# EAGLE design bottom-pcb (EAGLE 6.4)
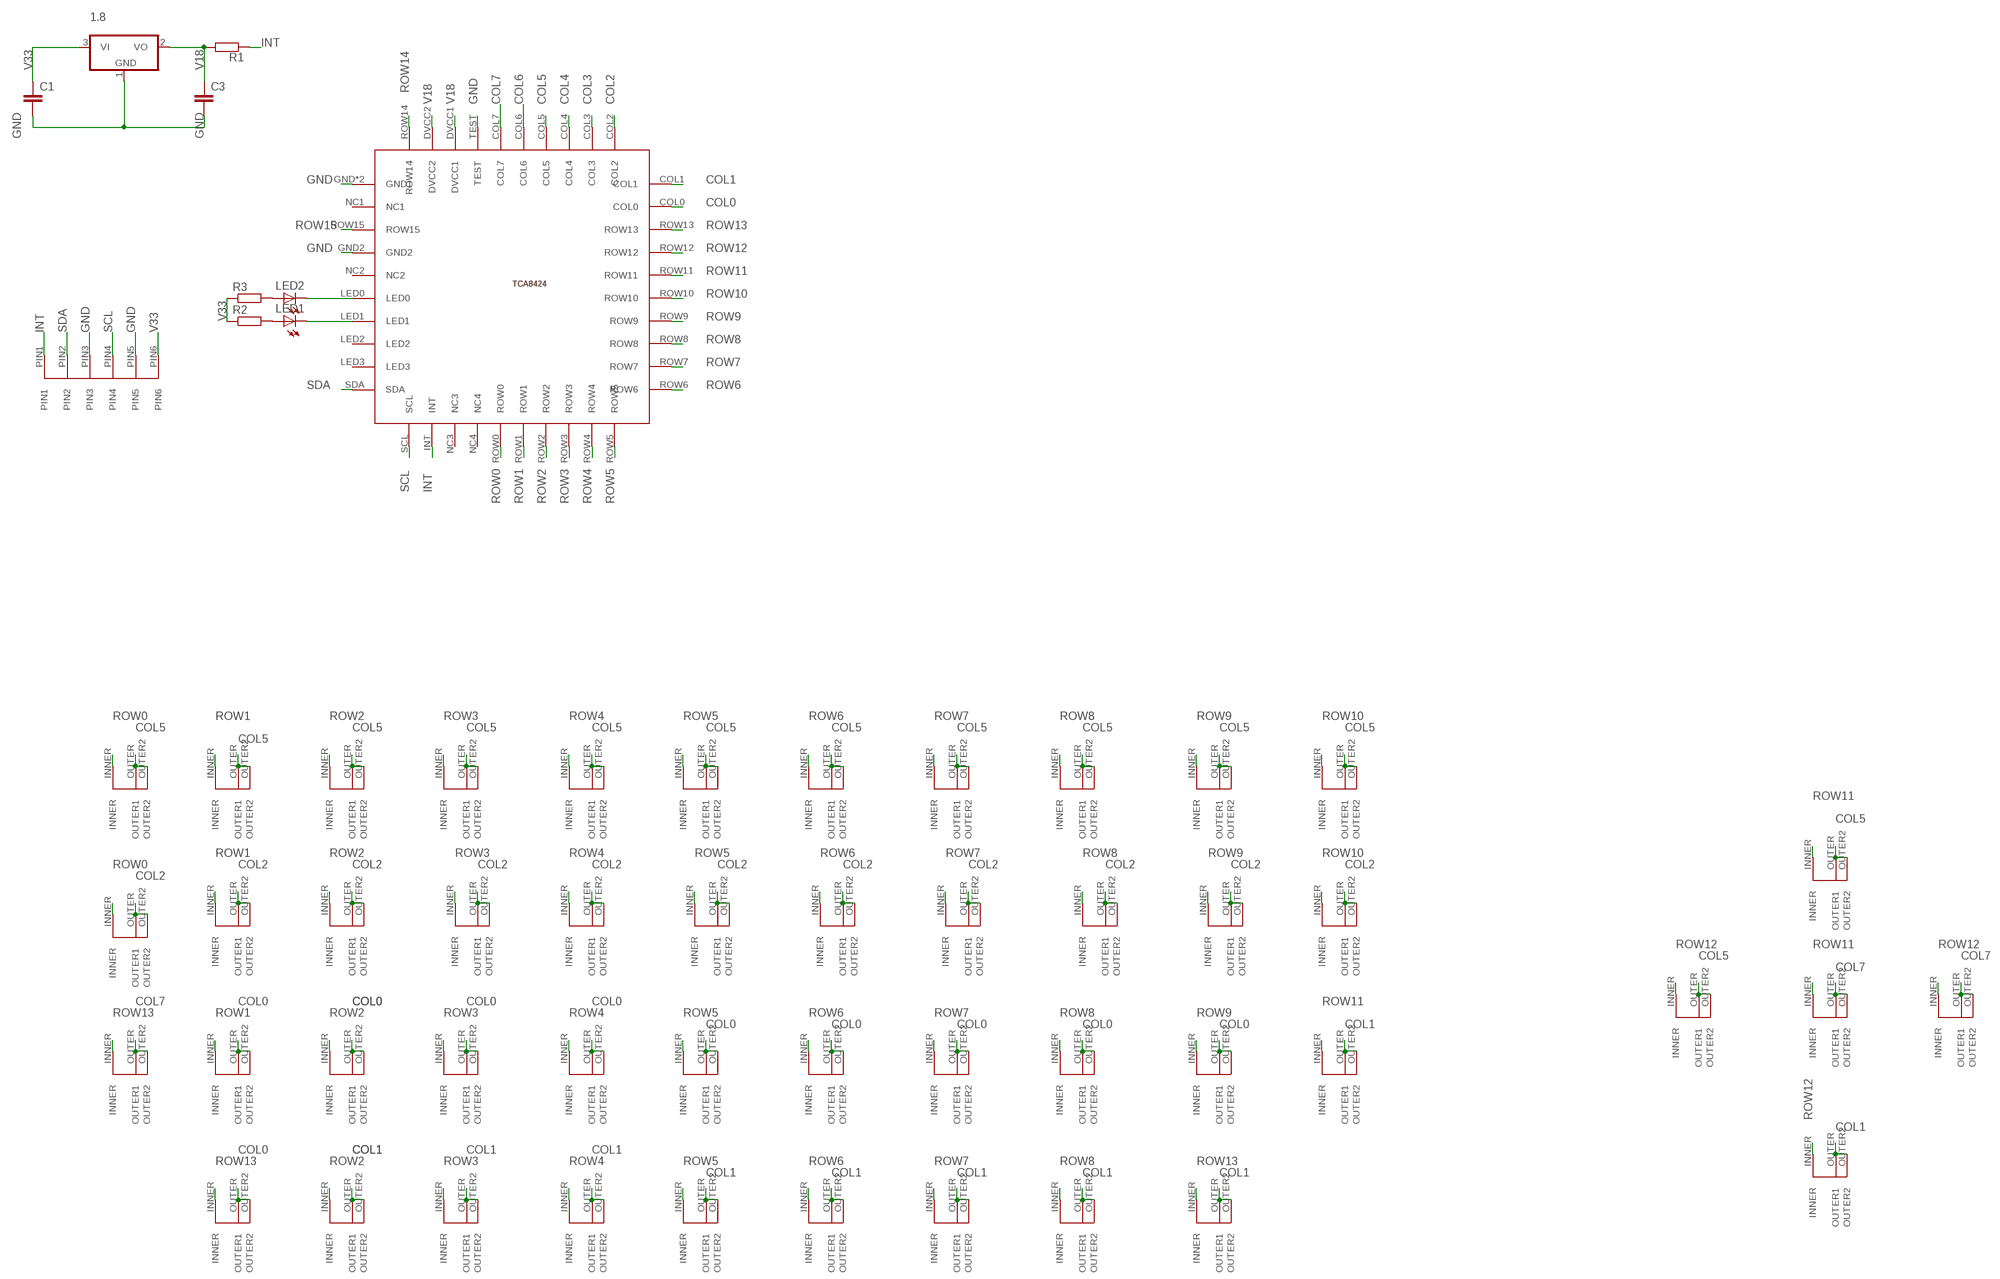
[diagram p0: schematic, sheet 1]

## Parts
1.8  MCP1703CB  [SOT23]
?  BUTTON  [BUTTON]
A  BUTTON  [BUTTON]
ARROWDOWN  BUTTON  [BUTTON]
ARROWLEFT  BUTTON  [BUTTON]
ARROWRIGHT  BUTTON  [BUTTON]
ARROWUP  BUTTON  [BUTTON]
AT  BUTTON  [BUTTON]
B  BUTTON  [BUTTON]
C  BUTTON  [BUTTON]
C1  C-EUC0603  [C0603]
C3  C-EUC0603  [C0603]
D  BUTTON  [BUTTON]
DEL  BUTTON  [BUTTON]
E3  BUTTON  [BUTTON]
ENTER  BUTTON  [BUTTON]
F  BUTTON  [BUTTON]
G  BUTTON  [BUTTON]
H  BUTTON  [BUTTON]
I8  BUTTON  [BUTTON]
J  BUTTON  [BUTTON]
K  BUTTON  [BUTTON]
KOMMA  BUTTON  [BUTTON]
L  BUTTON  [BUTTON]
LED1  LEDCHIPLED_0603  [CHIPLED_0603]
LED2  LEDCHIPLED_0603  [CHIPLED_0603]
LEFT-ALT  BUTTON  [BUTTON]
LIST  BUTTON  [BUTTON]
M  BUTTON  [BUTTON]
N  BUTTON  [BUTTON]
O9  BUTTON  [BUTTON]
OK  BUTTON  [BUTTON]
P0  BUTTON  [BUTTON]
PUNT  BUTTON  [BUTTON]
Q1  BUTTON  [BUTTON]
R1  R-EU_R0603  [R0603]
R2  R-EU_R0603  [R0603]
R3  R-EU_R0603  [R0603]
R4  BUTTON  [BUTTON]
RIGHT-ALT  BUTTON  [BUTTON]
S  BUTTON  [BUTTON]
SEARCH  BUTTON  [BUTTON]
SHIFT  BUTTON  [BUTTON]
SHIFT2  BUTTON  [BUTTON]
SLASH  BUTTON  [BUTTON]
SPACE1  BUTTON  [BUTTON]
SPACE2  BUTTON  [BUTTON]
SPACE3  BUTTON  [BUTTON]
T5  BUTTON  [BUTTON]
TCA8424-1  QFN40-TCA8424  [QFN40-TCA8424]
U7  BUTTON  [BUTTON]
U$1  6PCONNECTOR  [6PCONNECTOR]
V  BUTTON  [BUTTON]
W2  BUTTON  [BUTTON]
X  BUTTON  [BUTTON]
Y6  BUTTON  [BUTTON]
Z  BUTTON  [BUTTON]

## Nets
COL0: B.OUTER2 B.OUTER(OUTER1) C.OUTER2 C.OUTER(OUTER1) KOMMA.OUTER2 KOMMA.OUTER(OUTER1) LEFT-ALT.OUTER2 LEFT-ALT.OUTER(OUTER1) M.OUTER2 M.OUTER(OUTER1) N.OUTER2 N.OUTER(OUTER1) PUNT.OUTER2 PUNT.OUTER(OUTER1) TCA8424-1.COL0 V.OUTER2 V.OUTER(OUTER1) X.OUTER2 X.OUTER(OUTER1) Z.OUTER2 Z.OUTER(OUTER1)
COL1: ARROWDOWN.OUTER2 ARROWDOWN.OUTER(OUTER1) AT.OUTER2 AT.OUTER(OUTER1) LIST.OUTER2 LIST.OUTER(OUTER1) RIGHT-ALT.OUTER2 RIGHT-ALT.OUTER(OUTER1) SEARCH.OUTER2 SEARCH.OUTER(OUTER1) SHIFT2.OUTER2 SHIFT2.OUTER(OUTER1) SLASH.OUTER2 SLASH.OUTER(OUTER1) SPACE1.OUTER2 SPACE1.OUTER(OUTER1) SPACE2.OUTER2 SPACE2.OUTER(OUTER1) SPACE3.OUTER2 SPACE3.OUTER(OUTER1) TCA8424-1.COL1
COL2: ?.OUTER2 ?.OUTER(OUTER1) A.OUTER2 A.OUTER(OUTER1) D.OUTER2 D.OUTER(OUTER1) ENTER.OUTER2 ENTER.OUTER(OUTER1) F.OUTER2 F.OUTER(OUTER1) G.OUTER2 G.OUTER(OUTER1) H.OUTER2 H.OUTER(OUTER1) J.OUTER2 J.OUTER(OUTER1) K.OUTER2 K.OUTER(OUTER1) L.OUTER2 L.OUTER(OUTER1) S.OUTER2 S.OUTER(OUTER1) TCA8424-1.COL2
COL3: TCA8424-1.COL3
COL4: TCA8424-1.COL4
COL5: ARROWLEFT.OUTER2 ARROWLEFT.OUTER(OUTER1) ARROWUP.OUTER2 ARROWUP.OUTER(OUTER1) DEL.OUTER2 DEL.OUTER(OUTER1) E3.OUTER2 E3.OUTER(OUTER1) I8.OUTER2 I8.OUTER(OUTER1) O9.OUTER2 O9.OUTER(OUTER1) P0.OUTER2 P0.OUTER(OUTER1) Q1.OUTER2 Q1.OUTER(OUTER1) R4.OUTER2 R4.OUTER(OUTER1) T5.OUTER2 T5.OUTER(OUTER1) TCA8424-1.COL5 U7.OUTER2 U7.OUTER(OUTER1) W2.OUTER2 W2.OUTER(OUTER1) Y6.OUTER2 Y6.OUTER(OUTER1)
COL6: TCA8424-1.COL6
COL7: ARROWRIGHT.OUTER2 ARROWRIGHT.OUTER(OUTER1) OK.OUTER2 OK.OUTER(OUTER1) SHIFT.OUTER2 SHIFT.OUTER(OUTER1) TCA8424-1.COL7
GND: 1.8.1(GND) C1.2 C3.2 TCA8424-1.GND1 TCA8424-1.GND2 TCA8424-1.GND(GND1) TCA8424-1.TEST U$1.PIN3 U$1.PIN5
INT: R1.1 TCA8424-1.INT U$1.PIN1
N$6: LED1.C TCA8424-1.LED1
N$7: LED2.C TCA8424-1.LED0
N$8: LED1.A R2.2
N$9: LED2.A R3.2
ROW0: A.INNER Q1.INNER TCA8424-1.ROW0
ROW1: S.INNER TCA8424-1.ROW1 W2.INNER Z.INNER
ROW2: D.INNER E3.INNER SEARCH.INNER TCA8424-1.ROW2 X.INNER
ROW3: AT.INNER C.INNER F.INNER R4.INNER TCA8424-1.ROW3
ROW4: G.INNER SPACE1.INNER T5.INNER TCA8424-1.ROW4 V.INNER
ROW5: B.INNER H.INNER SPACE2.INNER TCA8424-1.ROW5 Y6.INNER
ROW6: J.INNER N.INNER SPACE3.INNER TCA8424-1.ROW6 U7.INNER
ROW7: I8.INNER K.INNER M.INNER SLASH.INNER TCA8424-1.ROW7
ROW8: KOMMA.INNER L.INNER LIST.INNER O9.INNER TCA8424-1.ROW8
ROW9: ?.INNER P0.INNER PUNT.INNER TCA8424-1.ROW9
ROW10: DEL.INNER ENTER.INNER TCA8424-1.ROW10
ROW11: ARROWUP.INNER OK.INNER SHIFT2.INNER TCA8424-1.ROW11
ROW12: ARROWDOWN.INNER ARROWLEFT.INNER ARROWRIGHT.INNER TCA8424-1.ROW12
ROW13: LEFT-ALT.INNER RIGHT-ALT.INNER SHIFT.INNER TCA8424-1.ROW13
ROW14: TCA8424-1.ROW14
ROW15: TCA8424-1.ROW15
SCL: TCA8424-1.SCL U$1.PIN4
SDA: TCA8424-1.SDA U$1.PIN2
V18: 1.8.2(VO) C3.1 R1.2 TCA8424-1.DVCC1 TCA8424-1.DVCC2
V33: 1.8.3(VI) C1.1 R2.1 R3.1 U$1.PIN6
Unconnected: TCA8424-1.LED2 TCA8424-1.LED3 TCA8424-1.NC1 TCA8424-1.NC2 TCA8424-1.NC3 TCA8424-1.NC4

## Library data of the parts
1.8 = linear:MCP1703: 250 mA, 16V, Low Quiescent Current LDO Regulator Source: http://ww1.microchip.com/downloads/en/DeviceDoc/22049b.pdf
? A ARROWDOWN ARROWLEFT ARROWRIGHT ARROWUP AT B C D DEL E3 ENTER F G H I8 J K KOMMA L LEFT-ALT LIST M N O9 OK P0 PUNT Q1 R4 RIGHT-ALT S SEARCH SHIFT SHIFT2 SLASH SPACE1-SPACE3 T5 U7 V W2 X Y6 Z = button:BUTTON
C1 C3 = rcl:C-EU: CAPACITOR, European symbol
LED1 LED2 = led:LED: LED OSRAM: - CHIPLED LG R971, LG N971, LY N971, LG Q971, LY Q971, LO R971, LY R971 LH N974, LH R974 LS Q976, LO Q976, LY Q976 LO Q996 - Hyper CHIPLED LW Q18S LB Q993, LB Q99A, LB R99A - SideLED LS A670, LO A670, LY A670, LG A670, LP A670 LB A673, LV A673, LT A673, LW A673 LH A674 LY A675 LS A676, LA A676, LO A676, LY A676, LW A676 LS A679, LY A679, LG A679 - Hyper Micro SIDELED® LS Y876, LA Y876, LO Y876, LY Y876 LT Y87S - SmartLED LW L88C, LW L88S LB L89C, LB L89S, LG L890 LS L89K, LO L89K, LY L89K LS L896, LA L896, LO L896, LY L896 - TOPLED LS T670, LO T670, LY T670, LG T670, LP T670 LSG T670, LSP T670, LSY T670, LOP T670, LYG T670 LG T671, LOG T671, LSG T671 LB T673, LV T673, LT T673, LW T673 LH T674 LS T676, LA T676, LO T676, LY T676, LB T676, LH T676, LSB T676, LW T676 LB T67C, LV T67C, LT T67C, LS T67K, LO T67K, LY T67K, LW E67C LS E67B, LA E67B, LO E67B, LY E67B, LB E67C, LV E67C, LT E67C LW T67C LS T679, LY T679, LG T679 LS T770, LO T770, LY T770, LG T770, LP T770 LB T773, LV T773, LT T773, LW T773 LH T774 LS E675, LA E675, LY E675, LS T675 LS T776, LA T776, LO T776, LY T776, LB T776 LHGB T686 LT T68C, LB T68C - Hyper Mini TOPLED® LB M676 - Mini TOPLED Santana® LG M470 LS M47K, LO M47K, LY M47K Source: http://www.osram.convergy.de LUXEON: - LUMILED® LXK2-PW12-R00, LXK2-PW12-S00, LXK2-PW14-U00, LXK2-PW14-V00 LXK2-PM12-R00, LXK2-PM12-S00, LXK2-PM14-U00 LXK2-PE12-Q00, LXK2-PE12-R00, LXK2-PE12-S00, LXK2-PE14-T00, LXK2-PE14-U00 LXK2-PB12-K00, LXK2-PB12-L00, LXK2-PB12-M00, LXK2-PB14-N00, LXK2-PB14-P00, LXK2-PB14-Q00 LXK2-PR12-L00, LXK2-PR12-M00, LXK2-PR14-Q00, LXK2-PR14-R00 LXK2-PD12-Q00, LXK2-PD12-R00, LXK2-PD12-S00 LXK2-PH12-R00, LXK2-PH12-S00 LXK2-PL12-P00, LXK2-PL12-Q00, LXK2-PL12-R00 Source: www.luxeon.com KINGBRIGHT: KA-3528ASYC Source: www.kingbright.com
R1 = resistor:R-EU_: RESISTOR, European symbol
R2 R3 = rcl:R-EU_: RESISTOR, European symbol
TCA8424-1 = TCA8424:QFN40-TCA8424
U$1 = 6Pconnector:6PCONNECTOR

## Board
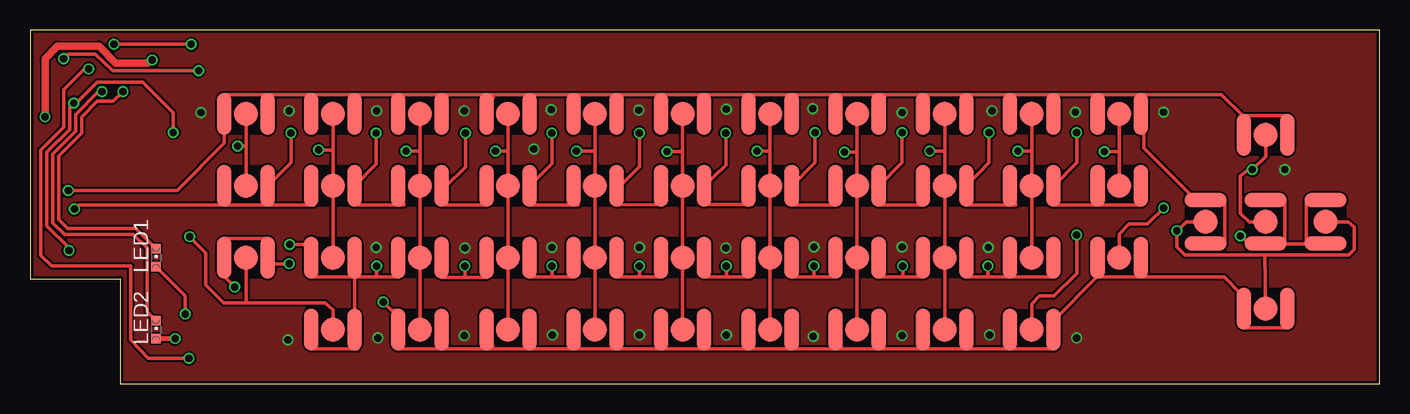
[diagram p1: board, top side]
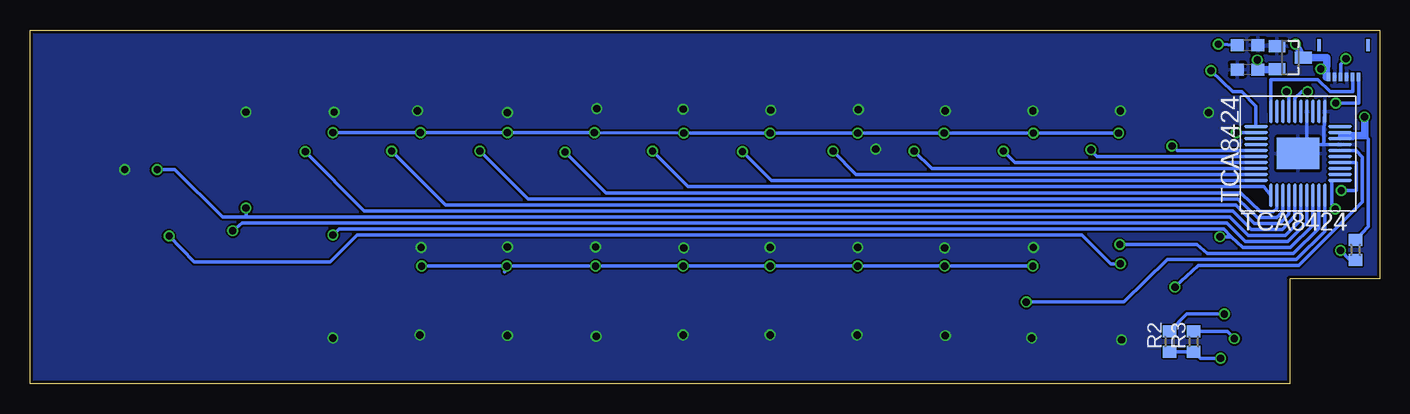
[diagram p2: board, bottom side, seen from below]

Size 112.5 x 29.5 mm. Coordinates in mm from the lower left corner, seen from the top.
Outline: 7.5,0 112.5,0 112.5,29.5 0,29.5 0,8.75 7.5,8.75 7.5,0
Copper layers (1*2*15*16): Top 0.035mm / dielectric 0.2mm / Route2 0.0175mm / dielectric 1.1mm / Route15 0.0175mm / dielectric 0.2mm / Bottom 0.035mm
Design rules "SeeedStudio_DRU_no_angle_20130527": minimum track width 6mil, minimum drill 12mil, track to track 6mil, track to pad 6mil, pad to pad 6mil, via to via 6mil, smd to smd 0mil, copper to edge 10mil, drill to drill 10mil, minimum pad ring 6mil, minimum via ring 6mil, stop-mask expansion 2mil, vias tented up to drill 25mil, thermal gap 10mil

### Footprints (pad centres in the part's own frame; a part is rotated, then mirrored left to right if it is on the bottom)
SOT23 = smd 1 x 1.4: 1 -0.95,-1.1; 2 0.95,-1.1; 3 0,1.1
BUTTON = smd 2 x 2: INNER 0,0 | smd 1.2 x 3.5: OUTER -1.8,0; OUTER2 1.8,0
C0603 = smd 1.1 x 1: 1 -0.85,0; 2 0.85,0
CHIPLED_0603 = smd 0.8 x 0.8: A 0,-0.75; C 0,0.75
R0603 = smd 1 x 1.1: 1 -0.85,0; 2 0.85,0
QFN40-TCA8424 = smd 2 x 0.25: COL0 3.5,1.75; COL1 3.5,2.25; GND1 -3.5,2.25; GND2 -3.5,0.75; LED0 -3.5,-0.25; LED1 -3.5,-0.75; LED2 -3.5,-1.25; LED3 -3.5,-1.75; NC1 -3.5,1.75; NC2 -3.5,0.25; ROW6 3.5,-2.25; ROW7 3.5,-1.75; ROW8 3.5,-1.25; ROW9 3.5,-0.75; ROW10 3.5,-0.25; ROW11 3.5,0.25; ROW12 3.5,0.75; ROW13 3.5,1.25; ROW15 -3.5,1.25; SDA -3.5,-2.25 | smd 0.25 x 2: COL2 2.25,3.5; COL3 1.75,3.5; COL4 1.25,3.5; COL5 0.75,3.5; COL6 0.25,3.5; COL7 -0.25,3.5; DVCC1 -1.25,3.5; DVCC2 -1.75,3.5; INT -1.75,-3.5; NC3 -1.25,-3.5; NC4 -0.75,-3.5; ROW0 -0.25,-3.5; ROW1 0.25,-3.5; ROW2 0.75,-3.5; ROW3 1.25,-3.5; ROW4 1.75,-3.5; ROW5 2.25,-3.5; ROW14 -2.25,3.5; SCL -2.25,-3.5; TEST -0.75,3.5 | smd 2.62 x 3.52: GND 0,0
6PCONNECTOR = smd 0.3 x 1: GND1 -2.05,-2.3; GND2 2.05,-2.3 | smd 0.3 x 0.7: PIN1 -1.25,0.35; PIN2 -0.75,0.35; PIN3 -0.25,0.35; PIN4 0.25,0.35; PIN5 0.75,0.35; PIN6 1.25,0.35

### Placement (x,y rotation side)
1.8  7.45,27.2 270 bottom
?  83.5,16.5 0 top
A  18,16.5 0 top
ARROWDOWN  103,6.25 0 top
ARROWLEFT  98,13.5 90 top
ARROWRIGHT  108,13.5 90 top
ARROWUP  103,20.75 0 top
AT  39.85,4.5 0 top
B  54.4,10.5 0 top
C  39.85,10.5 0 top
C1  11,28.25 0 bottom
C3  11,26.2 180 bottom
D  32.5,16.5 0 top
DEL  90.8,22.5 0 top
E3  32.5,22.5 0 top
ENTER  90.8,16.5 0 top
F  39.85,16.5 0 top
G  47.1,16.5 0 top
H  54.4,16.5 0 top
I8  68.95,22.5 0 top
J  61.7,16.5 0 top
K  68.95,16.5 0 top
KOMMA  76.25,10.5 0 top
L  76.25,16.5 0 top
LED1  10.5,10.5 0 top
LED2  10.5,4.5 0 top
LEFT-ALT  25.25,4.5 0 top
LIST  76.25,4.5 0 top
M  68.95,10.5 0 top
N  61.7,10.5 0 top
O9  76.25,22.5 0 top
OK  103,13.5 90 top
P0  83.5,22.5 0 top
PUNT  83.5,10.5 0 top
Q1  18,22.5 0 top
R1  2,11.15 90 bottom
R2  17.5,3.5 90 bottom
R3  15.5,3.5 90 bottom
R4  39.85,22.5 0 top
RIGHT-ALT  83.5,4.5 0 top
S  25.25,16.5 0 top
SEARCH  32.5,4.5 0 top
SHIFT  18,10.5 0 top
SHIFT2  90.8,10.5 0 top
SLASH  68.95,4.5 0 top
SPACE1  47.1,4.5 0 top
SPACE2  54.4,4.5 0 top
SPACE3  61.7,4.5 0 top
T5  47.1,22.5 0 top
TCA8424-1  6.8,19.2 270 bottom
U7  61.7,22.5 0 top
U$1  3,25.95 180 bottom
V  47.1,10.5 0 top
W2  25.25,22.5 0 top
X  32.5,10.5 0 top
Y6  54.4,22.5 0 top
Z  25.25,10.5 0 top

### Tracks (layer width: path | path; a pad name or v marks a point on that pad's centre or on a via)
COL0  (via drill 0.6)
  Top 0.305: 23.75,10.05 23.4,11.4 23.4,11.6 v21.65,11.6 | 23.75,10.05 Z.OUTER | 23.75,10.05 23.4,8.9 27.05,8.9 | 27.05,8.9 27.35,8.9 | Z.OUTER2 27.35,10 27.35,8.9 | 27.35,8.9 28.9,8.9 | 28.9,8.9 30.7,8.9 X.OUTER | X.OUTER2 34.3,8.85 36.25,8.85 | 36.25,8.85 38.1,8.85 C.OUTER | 41.55,10 C.OUTER2 | 41.8,9.7 C.OUTER2 | C.OUTER2 41.65,8.9 43.5,8.9 | 43.5,8.9 45.35,8.9 45.75,10 V.OUTER 45.25,9.45 | 48.9,9.5 49.35,10 V.OUTER2 49,8.9 50.8,8.9 | 50.8,8.9 52.7,8.9 52.75,10 B.OUTER | B.OUTER2 56.2,8.9 58.05,8.9 | 58.05,8.9 59.85,8.9 N.OUTER | N.OUTER2 63.5,8.9 65.35,8.9 | 65.35,8.9 67.25,8.9 67.25,9.95 M.OUTER | M.OUTER2 70.75,8.9 72.75,8.9 | 72.75,8.9 74.5,8.9 74.8,10 KOMMA.OUTER | 79.85,8.9 78,8.9 KOMMA.OUTER2 78.35,9.35 | 79.85,8.9 81.7,8.9 82.15,10 PUNT.OUTER 81.9,8.9 85.25,8.9 85.6,10 PUNT.OUTER2 | v72.75,9.8 72.75,8.9 | 36.25,8.85 v36.25,9.8 | 28.9,8.9 v28.9,9.8 | v65.35,9.8 65.35,8.9 | v58.05,9.8 58.05,8.9 | v50.8,9.8 50.8,8.9 | v43.5,9.8 43.5,8.9 | v79.85,9.8 79.85,8.9 | 23.7,5.95 LEFT-ALT.OUTER 23.7,2.9 27.3,2.9 LEFT-ALT.OUTER2 27.05,8.9
  Bottom 0.305: TCA8424-1.COL0 5.05,12.95 7.2,10.85 14.35,10.85 15.25,11.6 v21.65,11.6 | v79.85,9.8 v72.75,9.8 | v72.75,9.8 v65.35,9.8 v58.05,9.8 v50.8,9.8 v43.5,9.8 v36.25,9.8 v28.9,9.8 | 72.95,9.3 v72.75,9.8
COL1  (via drill 0.6)
  Top 0.305: 34.35,2.9 30.7,2.9 SEARCH.OUTER 30.8,6.1 30.15,6.1 v29.45,6.8 | 34.35,2.9 34.35,4.5 SEARCH.OUTER2 34.8,2.9 | 34.35,2.9 38.1,2.9 | 38.65,2.9 38.1,2.9 | 38.1,2.9 AT.OUTER 38.65,2.9 | 38.65,2.9 41.75,2.9 | AT.OUTER2 41.75,2.9 | 41.75,2.9 45.7,2.9 | 45.75,2.9 45.75,4.5 SPACE1.OUTER 45.7,2.9 | 45.7,2.9 45.75,2.9 | 45.75,2.9 49.3,2.9 | SPACE1.OUTER2 49.3,2.9 | 49.3,2.9 52.7,2.9 | 52.75,2.9 52.75,4.5 SPACE2.OUTER 52.7,2.9 | 52.7,2.9 52.75,2.9 | 52.75,2.9 56.3,2.9 | 56.35,2.9 56.35,4.5 SPACE2.OUTER2 56.3,2.9 | 56.3,2.9 56.35,2.9 | 56.35,2.9 60.2,2.9 | 60.25,2.9 60.25,4.5 SPACE3.OUTER 60.2,2.9 | 60.2,2.9 60.25,2.9 | 60.25,2.9 63.8,2.9 | SPACE3.OUTER2 63.8,2.9 | 63.8,2.9 67.15,2.9 | 67.15,2.9 SLASH.OUTER 67.7,2.9 | 67.15,2.9 70.85,2.9 | 70.85,2.9 70.9,4.5 SLASH.OUTER2 70.85,2.9 | 70.85,2.9 74.75,2.9 74.75,4.5 LIST.OUTER 74.7,2.9 78.35,2.9 78.35,4.5 LIST.OUTER2 78.3,2.9 81.75,2.9 | 81.8,2.9 RIGHT-ALT.OUTER 81.75,4.5 81.75,2.9 | 89.2,11.6 SHIFT2.OUTER 88.95,8.9 | 92.9,11.6 92.9,10 SHIFT2.OUTER2 92.6,8.9 | 88.95,8.9 92.6,8.9 | ARROWDOWN.OUTER2 104.8,4.65 101.2,4.65 ARROWDOWN.OUTER 101,6.55 100.95,7.5 99.55,8.9 92.6,8.9 | 81.75,2.9 85.25,2.9 85.25,4.5 RIGHT-ALT.OUTER2 85.3,5.25 88.95,8.9
  Bottom 0.305: TCA8424-1.COL1 4.55,12.7 6.95,10.35 17.7,10.35 21.3,6.8 v29.45,6.8
COL2  (via drill 0.6)
  Top 0.305: 15.9,14.9 19.8,14.9 | ENTER.OUTER 89.2,14.9 | 89.2,14.9 85.4,14.9 85.35,16.5 | 85.35,16.5 ?.OUTER2 | ENTER.OUTER2 92.45,15.15 | 92.45,15.15 92.5,14.9 89.2,14.9 | ?.OUTER 82.2,14.9 78.35,14.9 78.35,16.5 L.OUTER2 79.95,18.45 v79.95,20.95 | L.OUTER 74.45,14.9 70.8,14.9 K.OUTER2 72.7,18.45 v72.7,20.95 | K.OUTER 67.15,14.9 63.8,14.9 J.OUTER2 65.45,18.45 v65.45,20.95 | J.OUTER 60.2,14.95 56.35,14.95 56.35,16.5 H.OUTER2 58,18.25 v58,20.9 | H.OUTER 52.7,14.95 49,14.9 49.2,16.5 | 49.2,16.5 G.OUTER2 | G.OUTER 45.7,14.9 41.7,14.9 F.OUTER2 43.5,18.35 v43.5,20.9 | F.OUTER 38.1,14.9 34.7,14.9 34.7,16.5 | 34.7,16.5 D.OUTER2 | D.OUTER 31.2,14.9 27.3,14.9 S.OUTER2 28.85,18.3 v28.85,20.9 | 19.8,14.9 A.OUTER2 21.75,18.45 v21.75,20.9 | 19.8,14.9 23.7,14.9 S.OUTER | 49.2,16.5 50.8,18.1 v50.8,20.9 | 92.55,15 92.45,15.15 | v3.7,14.55 4.05,14.9 15.9,14.9 | 15.9,14.9 A.OUTER | 85.35,16.5 87.25,18.45 v87.25,20.95 | 34.7,16.5 36.3,18.05 v36.3,20.9
  Bottom 0.305: v21.75,20.9 v28.85,20.9 v36.3,20.9 v43.5,20.9 v50.8,20.9 v58,20.9 v65.45,20.95 v72.7,20.95 v79.95,20.95 v87.25,20.95 | TCA8424-1.COL2 4,16.95 4,14.9 v3.7,14.55
COL5  (via drill 0.6)
  Top 0.305: 23.7,24.1 19.8,24.1 Q1.OUTER2 19.85,22.5 19.85,24.1 16.2,24.1 Q1.OUTER 16.2,20.05 12.25,16.1 v3.2,16.1 | W2.OUTER 23.7,24.1 | 23.7,24.1 27.3,24.1 | W2.OUTER2 27.3,24.1 | 27.3,24.1 31.2,24.1 | E3.OUTER 31.2,24.1 | 31.2,24.1 34.8,24.1 | E3.OUTER2 34.8,24.1 | 34.8,24.1 38.7,24.1 | R4.OUTER 38.7,24.1 | 38.7,24.1 41.55,24.1 | 41.55,24.1 41.65,24.1 | 41.65,24.1 R4.OUTER2 41.55,24.1 | 41.65,24.1 45.7,24.1 | 45.75,24.1 45.75,22.5 T5.OUTER 45.7,24.1 | 45.7,24.1 45.75,24.1 | 45.75,24.1 49.3,24.1 | 49.3,24.1 49.35,24.1 | 49.35,24.1 49.35,22.5 T5.OUTER2 49.3,24.1 | 49.35,24.1 52.7,24.1 | Y6.OUTER 52.7,24.1 | 52.7,24.1 56.35,24.1 56.35,22.5 Y6.OUTER2 56.3,24.1 60.25,24.1 60.25,22.5 U7.OUTER 60.2,24.1 63.8,24.1 | U7.OUTER2 63.8,24.1 | 63.8,24.1 67.7,24.1 | I8.OUTER 67.7,24.1 | 67.7,24.1 71.3,24.1 | I8.OUTER2 71.3,24.1 | 71.3,24.1 74.7,24.1 | O9.OUTER 74.7,24.1 | 74.7,24.1 78.3,24.1 | 78.3,24.1 78.35,24.1 | 78.35,24.1 78.35,22.5 O9.OUTER2 78.3,24.1 | 78.35,24.1 81.7,24.1 | P0.OUTER 81.7,24.1 | 81.7,24.1 85.3,24.1 | 85.3,24.1 85.35,24.1 | 85.35,24.1 85.35,22.5 P0.OUTER2 85.3,24.1 | 85.35,24.1 89.2,24.1 | DEL.OUTER 89.2,24.1 | 89.2,24.1 92.85,24.1 | 92.85,24.1 92.85,22.5 | 92.85,22.5 DEL.OUTER2 | ARROWLEFT.OUTER 98.5,11.85 99.6,11.75 99.6,15.3 ARROWLEFT.OUTER2 96.95,15.55 92.85,19.65 92.85,22.5 | ARROWUP.OUTER2 104.9,22.35 101.1,22.35 | 101.1,22.35 101,21.25 101.2,22.05 | 101.35,19.7 ARROWUP.OUTER 101.1,22.35 | 101.1,22.35 99.3,24.1 92.85,24.1
  Bottom 0.305: TCA8424-1.COL5 1.95,18.45 1.95,16.1 v3.2,16.1
COL7  (via drill 0.6)
  Top 0.305: ARROWRIGHT.OUTER2 106.4,15.35 106.4,11.65 | 106.4,11.65 ARROWRIGHT.OUTER 108.2,11.95 | v17.05,8.05 16.3,8.8 16.2,9.5 | 16.1,10.1 16.2,9.5 | 16.2,9.5 SHIFT.OUTER 16.15,12.1 19.8,12.1 SHIFT.OUTER2 19.85,10.45 19.85,9.75 20.1,10 v21.6,10 | 104.6,11.65 OK.OUTER 101.65,11.7 v100.9,12.3 | 104.6,11.65 106.4,11.65 | OK.OUTER2 104.6,15.25 104.6,11.65
  Bottom 0.305: TCA8424-1.COL7 1.95,19.45 1.45,18.9 1.45,15.15 6.75,9.85 15.1,9.85 v17.05,8.05 | v100.9,12.3 98.8,10.15 87.5,10.15 85.25,12.4 24.8,12.4 22.4,10 v21.6,10
GND  (via drill 0.6)
  Bottom 0.305: 6.05,20.2 6.05,19.95 4.65,19.95 | 6.05,20.2 TCA8424-1.GND2 | TCA8424-1.TEST 4.65,19.95 | TCA8424-1.GND 6.8,19.45 6.05,20.2 | TCA8424-1.GND1 4.65,21.1 4.65,19.95
  other vias: 94.5,22.65 80.2,22.75 87.15,22.65 21.6,22.75 28.9,22.75 36.2,22.75 43.45,22.85 58.05,22.9 65.25,22.95 72.7,22.6 50.75,22.8 72.7,11.4 65.35,11.4 58,11.3 50.8,11.35 36.25,11.3 28.85,11.35 43.5,11.35 72.7,4 65.3,3.95 58.05,4.05 50.8,4.05 43.55,4.05 36.2,4 79.9,11.35 14.25,22.6 87.25,3.8 42,19.55 80,4.05 29,3.8 104.6,17.85 21.5,3.65
  pour Bottom: 7.5,0 112.5,0 112.5,29.5 0,29.5 0,8.75 7.5,8.75
  pour Top: 7.5,0 112.5,0 112.5,29.5 0,29.5 0,8.75 7.5,8.75
INT  (via drill 0.6)
  Top 0.305: v3.25,11.1 3.25,11.3 1.4,13.15 1.4,19.3 3.3,21.2 3.3,23.05 v3.65,23.4 3.85,23.4 5.6,25.15 9.4,25.15 11.95,22.6 v11.95,20.95
  Bottom 0.305: U$1.PIN1 1.75,23.4 v3.65,23.4 | TCA8424-1.INT v11.95,20.95 | R1.1 2.5,10.3 v3.25,11.1
N$1
  cutout Top: 23.4,12.1 27.05,12.1 27.15,9.15 23.1,9.1
  cutout Top: 16.15,12.1 19.95,12.1 19.85,8.9 16.2,8.9
N$2
  cutout Top: 16.45,24 19.8,24 19.8,20.9 16.45,20.9
N$3
  cutout Top: 23.5,20.9 27.15,20.9 27.15,24 23.25,24.05
  cutout Top: 30.7,20.9 34.35,20.9 34.2,24 30.55,24
  cutout Top: 45.35,20.9 48.9,20.9 48.8,23.85 45.2,23.95
  cutout Top: 38,20.9 41.7,20.9 41.8,24.05 38.05,24.1
  cutout Top: 52.7,20.95 56.2,21 56.2,24 52.45,23.9
  cutout Top: 60.2,20.9 63.55,20.9 63.85,22.35 60.2,22.35
  cutout Top: 67.1,20.9 70.8,20.9 70.8,24 67.1,24
  cutout Top: 74.45,20.9 78.05,20.9 78.05,24 74.35,24
  cutout Top: 81.7,20.9 85.35,20.95 85.25,24 81.6,23.95
  cutout Top: 89.2,20.9 92.85,20.9 92.85,22.35 89.2,22.35
  cutout Top: 101.15,19.15 104.85,19.15 104.95,22.25 101.25,22.25
  cutout Top: 101.15,4.85 104.8,4.8 104.85,7.85 101.2,7.85
  cutout Top: 101.4,11.95 104.65,11.9 104.5,15.4 101.4,15.55
  cutout Top: 109.6,11.9 109.6,15.35 106.6,15.35 106.65,11.6
  cutout Top: 99.55,11.95 99.55,15.6 96.4,15.55 96.4,11.9
  cutout Top: 89.2,16.65 92.85,16.65 92.65,18.1 89.2,18.1
  cutout Top: 89,9 92.65,9 92.65,12.1 89,12.05
  cutout Top: 82.05,9.15 85.3,9.05 85.45,12.1 81.7,12.1
  cutout Top: 81.65,3.1 85.25,3.1 85.4,6.05 81.7,6.1
  cutout Top: 74.7,4.65 78.35,4.65 78.05,6.1 74.4,6.1
  cutout Top: 67.2,3.3 70.75,3.25 70.75,6.1 67.15,6.1
  cutout Top: 59.95,3.3 63.4,3.1 63.55,6.1 60,6.1
  cutout Top: 52.6,3.15 56.1,3.2 56.3,6.1 52.65,6.1
  cutout Top: 45.3,3.1 49,2.95 48.95,6.1 45.3,6.1
  cutout Top: 37.9,3 41.55,3.1 41.7,6.1 38,6.1
  cutout Top: 30.55,3.05 34.3,3.05 34.3,6.1 30.7,6.1
  cutout Top: 23.35,3.1 27,3.1 27.1,6.15 23.45,6.15
N$4
  cutout Top: 16.15,18.1 19.9,18.1 19.85,14.9 16.15,14.9
  cutout Top: 23.45,18.1 27.15,18.1 27.2,14.9 23.5,14.9
  cutout Top: 30.65,18.1 34.35,18.15 34.4,14.9 30.75,14.9
  cutout Top: 37.95,18.1 41.65,18.1 41.65,14.9 38.1,14.9
  cutout Top: 45.3,18.1 48.95,18.1 48.9,14.9 45.2,14.9
  cutout Top: 52.6,18.1 56.3,18.1 56.35,14.9 52.65,14.9
  cutout Top: 59.85,18.1 63.5,18.1 63.45,14.95 59.9,14.9
  cutout Top: 67.1,18.1 70.85,18.1 70.85,14.9 67.2,14.9
  cutout Top: 74.45,18.1 78.05,18.05 78.05,14.9 74.45,14.9
  cutout Top: 81.75,18.1 85.3,18.1 85.3,14.9 81.8,14.9
  cutout Top: 74.4,12.1 78.15,12.1 78.1,8.9 74.4,8.95
  cutout Top: 67.15,12.1 70.8,12.1 70.85,8.9 67.1,8.95
  cutout Top: 59.9,12.1 63.6,12.1 63.4,8.9 59.9,8.9
  cutout Top: 52.65,12.1 56.2,12.1 56.25,8.9 52.55,8.95
  cutout Top: 45.25,12.1 48.95,12.1 49,8.9 45.25,9
  cutout Top: 38.05,12.1 41.7,12.1 41.65,8.9 38,8.85
  cutout Top: 30.65,12.1 34.25,12.1 34.3,8.9 30.7,8.95
N$6  (via drill 0.6)
  Top 0.305: LED1.C 8.8,12.95 3.15,12.95 2.4,13.7 2.4,19 4.3,20.9 4.3,22.25 5.6,23.55 6.95,23.55 v7.75,24.35
  Bottom 0.305: TCA8424-1.LED1 7.55,24.15 v7.75,24.35
N$7  (via drill 0.6)
  Top 0.305: v6,24.35 5.7,24.35 3.8,22.45 3.8,21.05 1.9,19.15 1.9,13.4 2.9,12.45 8.6,12.45 9.75,11.3 9.75,6 LED2.C
  Bottom 0.305: TCA8424-1.LED0 7.05,23.8 6.5,24.35 v6,24.35
N$8  (via drill 0.6)
  Top 0.305: LED1.A 12.95,7.3 v12.95,5.8
  Bottom 0.305: v12.95,5.8 16.05,5.8 R2.2
N$9  (via drill 0.6)
  Top 0.406: v12.1,3.75 LED2.A
  Bottom 0.305: v12.1,3.75 12.7,4.35 R3.2
ROW0  (via drill 0.6)
  Top 0.305: Q1.INNER 18,19.8 | 18,19.8 A.INNER | v17.3,19.8 18,19.8
  Bottom 0.305: TCA8424-1.ROW0 16.85,19.45 v17.3,19.8
ROW1  (via drill 0.6)
  Top 0.305: W2.INNER 25.25,19.5 | v24.05,19.5 25.25,19.5 | 25.25,19.5 S.INNER Z.INNER
  Bottom 0.305: TCA8424-1.ROW1 23.55,18.95 v24.05,19.5
ROW2  (via drill 0.6)
  Top 0.305: SEARCH.INNER X.INNER D.INNER 32.5,19.5 | E3.INNER 32.5,19.5 | v31.35,19.4 32.4,19.4 32.5,19.5
  Bottom 0.305: TCA8424-1.ROW2 30.4,18.45 v31.35,19.4
ROW3  (via drill 0.6)
  Top 0.305: AT.INNER C.INNER F.INNER 39.85,19.4 | R4.INNER 39.85,19.4 | v38.8,19.4 39.85,19.4
  Bottom 0.305: TCA8424-1.ROW3 37.3,17.95 v38.8,19.4
ROW4  (via drill 0.6)
  Top 0.305: SPACE1.INNER V.INNER G.INNER 47.1,19.4 | T5.INNER 47.1,19.4 | v45.55,19.4 47.1,19.4
  Bottom 0.305: TCA8424-1.ROW4 43.65,17.45 v45.55,19.4
ROW5  (via drill 0.6)
  Top 0.305: SPACE2.INNER B.INNER H.INNER 54.4,19.35 | Y6.INNER 54.4,19.35 | v53.1,19.35 54.4,19.35
  Bottom 0.305: TCA8424-1.ROW5 50.7,16.95 v53.1,19.35
ROW6  (via drill 0.6)
  Top 0.305: SPACE3.INNER N.INNER J.INNER 61.7,19.4 | v60.6,19.4 61.7,19.4 | 61.7,19.4 U7.INNER
  Bottom 0.305: TCA8424-1.ROW6 9.65,16.45 57.65,16.45 v60.6,19.4
ROW7  (via drill 0.6)
  Top 0.305: SLASH.INNER M.INNER K.INNER 68.95,19.3 | v67.9,19.3 68.95,19.3 | 68.95,19.3 I8.INNER
  Bottom 0.305: TCA8424-1.ROW7 8.55,14.6 8.85,14.35 9.95,14.35 11.55,15.9 64.5,15.9 v67.9,19.3
ROW8  (via drill 0.6)
  Top 0.305: LIST.INNER KOMMA.INNER L.INNER 76.25,19.4 | v75,19.4 76.25,19.4 | 76.25,19.4 O9.INNER
  Bottom 0.305: TCA8424-1.ROW8 8.05,14.35 8.55,13.85 10.2,13.85 11.8,15.4 71,15.4 v75,19.4
ROW9  (via drill 0.6)
  Top 0.305: PUNT.INNER ?.INNER 83.5,19.4 | 83.5,19.4 P0.INNER | v82.35,19.4 83.5,19.4
  Bottom 0.305: TCA8424-1.ROW9 7.55,14.15 8.3,13.35 10.45,13.35 12,14.9 77.85,14.9 v82.35,19.4
ROW10  (via drill 0.6)
  Top 0.305: ENTER.INNER 90.8,19.35 | 90.8,19.35 DEL.INNER | v89.55,19.35 90.8,19.35
  Bottom 0.305: TCA8424-1.ROW10 7.05,14 8.1,12.85 10.7,12.85 12.25,14.4 84.65,14.4 v89.55,19.35
ROW11  (via drill 0.6)
  Top 0.305: SHIFT2.INNER 90.8,12.5 91.6,13.3 93.15,13.3 v94.5,14.65 | OK.INNER 101.65,13.5 100.9,14.2 100.9,17.3 101.55,17.85 v101.9,17.85 103,18.95 ARROWUP.INNER
  Bottom 0.305: TCA8424-1.ROW11 6.55,13.65 7.85,12.35 10.95,12.35 12.5,13.9 94.6,13.9 | 94.6,13.9 96.45,13.9 100.45,17.85 v101.9,17.85 | v94.5,14.65 94.5,14 94.6,13.9
ROW12  (via drill 0.6)
  Top 0.305: ARROWRIGHT.INNER 109.9,13.5 110.4,13.05 110.4,11.2 109.95,10.75 102.95,10.75 | 103.15,6.45 ARROWDOWN.INNER 102.95,10.75 | 102.95,10.75 96.25,10.75 95.6,11.4 v95.6,12.75 96.4,13.5 ARROWLEFT.INNER
  Bottom 0.305: TCA8424-1.ROW12 6.05,13.45 7.65,11.85 11.2,11.85 12.75,13.4 94.8,13.4 v95.6,12.75
ROW13  (via drill 0.6)
  Top 0.305: LEFT-ALT.INNER 25.25,6.15 24.6,6.75 18,6.75 | v13.3,12.25 14.65,10.9 14.65,8.25 16.15,6.75 18,6.75 | SHIFT.INNER 18,6.75 | v87.25,12.4 87.25,9.2 85.35,7.3 84.15,7.3 83.5,6.65 RIGHT-ALT.INNER
  Bottom 0.305: TCA8424-1.ROW13 5.55,13.2 7.45,11.35 11.4,11.35 12.35,12.25 | v87.25,12.4 86.75,12.9 13,12.9 12.35,12.25 | 12.35,12.25 v13.3,12.25
SCL  (via drill 0.6)
  Top 0.305: v2.8,27.1 3.2,27.5 5.45,27.5 6.9,26.1 v14.05,26.1
  Bottom 0.305: TCA8424-1.SCL 10.3,23.15 11.5,24.35 12.25,24.35 v14.05,26.1 | v2.8,27.1 3.25,26.65 U$1.PIN4
SDA
  Bottom 0.305: TCA8424-1.SDA 9.05,25.35 5.15,25.35 4.1,24.35 2.25,24.35 U$1.PIN2
V18  (via drill 0.6)
  Top 0.61: v1.25,22.25 1.25,27.1 2.25,28.15 5.75,28.15 7.15,26.75 9.75,26.75 v10.2,27
  Bottom 0.305: 3.15,20.7 3.3,20.85 TCA8424-1.DVCC2 TCA8424-1.DVCC1 2.2,20.45 | R1.2 0.95,13.1 0.95,20.4 1.25,20.7
  Bottom 0.61: 3.15,20.7 1.25,20.7 v1.25,22.25 | 1.8.2 8.9,26.25 9.1,26.2 | 9.1,26.2 9,26.1 | v10.2,27 10.2,26.15 C3.1 9.1,26.2
V33  (via drill 0.6)
  Top 0.305: v7,28.3 v13.45,28.3 | v13.25,2.1 9.85,2.1 8.4,3.65 8.4,9.8 1.8,9.8 0.9,10.7 0.9,19.5 2.8,21.4 2.8,24.54 4.51,26.25 v4.9,26.25
  Bottom 0.305: 4.45,25.55 4.35,25.6 U$1.PIN6 4.5,26.1 v4.9,26.25 | v13.45,28.3 C1.1 | R2.1 R3.1 14.95,2.1 v13.25,2.1
  Bottom 0.61: 4.45,25.55 4.4,27.2 1.8.3 v7,28.3